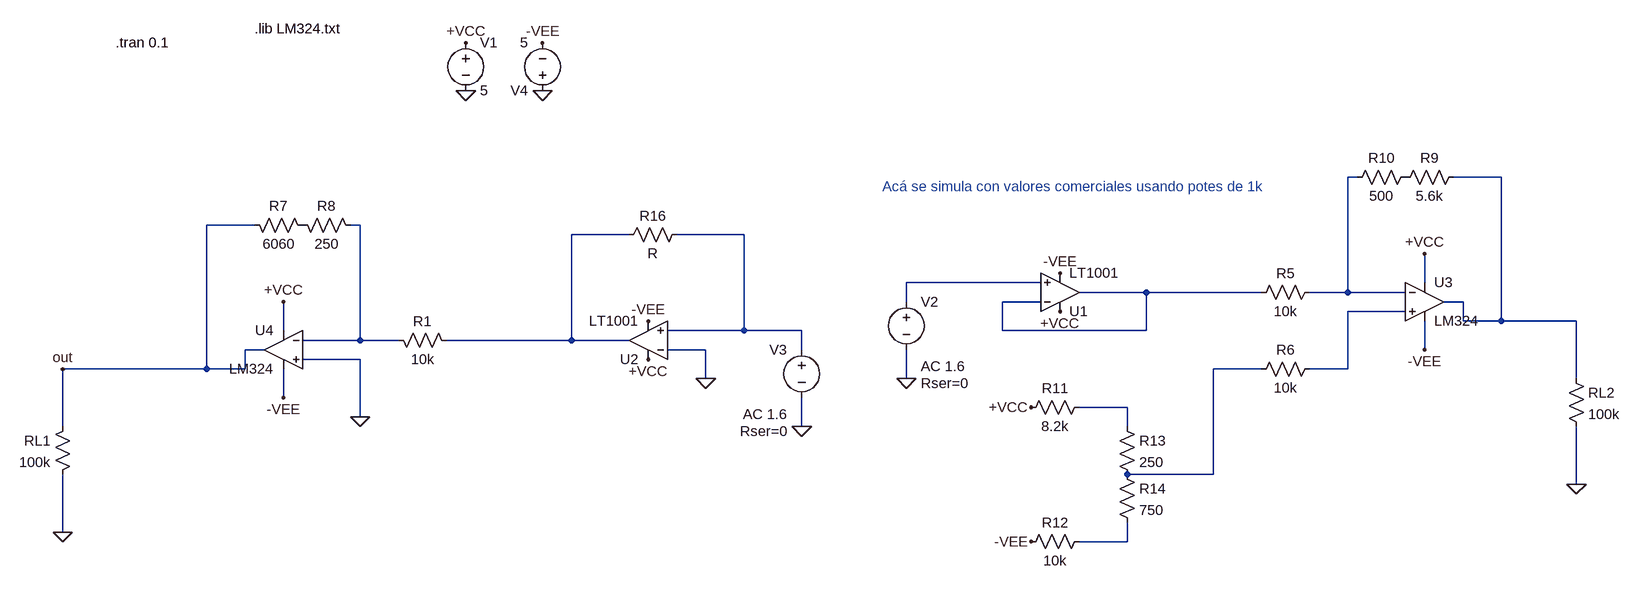
[diagram p0: schematic amplificador_adc_corriente.asc]
amplificador_adc_corriente.asc, the LTspice schematic file:
Version 4
SHEET 1 2452 980
WIRE 1888 -112 1872 -112
WIRE 2128 -112 2048 -112
WIRE -704 -32 -784 -32
WIRE -528 -32 -544 -32
WIRE -80 -16 -176 -16
WIRE 112 -16 0 -16
WIRE 1360 64 1136 64
WIRE 2000 64 2000 16
WIRE 1536 80 1424 80
WIRE 1728 80 1536 80
WIRE 1872 80 1872 -112
WIRE 1872 80 1808 80
WIRE 1968 80 1872 80
WIRE 1136 96 1136 64
WIRE 1360 96 1296 96
WIRE 2064 96 2032 96
WIRE 1968 112 1872 112
WIRE 2064 128 2064 96
WIRE 2128 128 2128 -112
WIRE 2128 128 2064 128
WIRE 2368 128 2128 128
WIRE -656 144 -656 96
WIRE 112 144 112 -16
WIRE 112 144 -16 144
WIRE 208 144 112 144
WIRE 1296 144 1296 96
WIRE 1536 144 1536 80
WIRE 1536 144 1296 144
WIRE -528 160 -528 -32
WIRE -528 160 -624 160
WIRE -464 160 -528 160
WIRE -176 160 -176 -16
WIRE -176 160 -384 160
WIRE -80 160 -176 160
WIRE -688 176 -720 176
WIRE 48 176 -16 176
WIRE 208 176 208 144
WIRE 2000 176 2000 128
WIRE -528 192 -624 192
WIRE -784 208 -784 -32
WIRE -784 208 -1024 208
WIRE -720 208 -720 176
WIRE -720 208 -784 208
WIRE 1728 208 1648 208
WIRE 1872 208 1872 112
WIRE 1872 208 1808 208
WIRE 48 224 48 176
WIRE 1136 224 1136 176
WIRE 2368 224 2368 128
WIRE -656 256 -656 208
WIRE 1504 272 1424 272
WIRE -528 288 -528 192
WIRE -1024 304 -1024 208
WIRE 208 304 208 256
WIRE 1504 304 1504 272
WIRE 1648 384 1648 208
WIRE 1648 384 1504 384
WIRE 2368 400 2368 304
WIRE -1024 480 -1024 384
WIRE 1504 496 1504 464
WIRE 1504 496 1424 496
FLAG -656 96 +VCC
FLAG -352 -256 0
FLAG -352 -336 +VCC
FLAG 208 304 0
FLAG -224 -256 0
FLAG -224 -336 -VEE
FLAG -656 256 -VEE
FLAG -48 192 +VCC
FLAG -48 128 -VEE
FLAG -1024 480 0
FLAG -1024 208 out
FLAG 2000 16 +VCC
FLAG 1136 224 0
FLAG 2000 176 -VEE
FLAG 1392 112 +VCC
FLAG 1392 48 -VEE
FLAG 2368 400 0
FLAG 1344 272 +VCC
FLAG 1344 496 -VEE
FLAG 48 224 0
FLAG -528 288 0
SYMBOL voltage -352 -352 R0
WINDOW 123 0 0 Left 2
WINDOW 39 0 0 Left 2
SYMATTR InstName V1
SYMATTR Value 5
SYMBOL voltage 208 160 M0
WINDOW 123 24 124 Left 2
WINDOW 39 24 152 Left 2
WINDOW 3 24 96 Invisible 2
SYMATTR Value2 AC 1.6
SYMATTR SpiceLine Rser=0
SYMATTR Value PWL TIME_SCALE_FACTOR=0.1 VALUE_SCALE_FACTOR=1 REPEAT FOREVER (file=triangularDAC_0a3.2V_256pts.txt) ENDREPEAT
SYMATTR InstName V3
SYMBOL res -480 144 M90
WINDOW 0 0 56 VBottom 2
WINDOW 3 32 56 VTop 2
SYMATTR InstName R1
SYMATTR Value 10k
SYMBOL voltage -224 -240 R180
WINDOW 123 0 0 Left 2
WINDOW 39 0 0 Left 2
SYMATTR InstName V4
SYMATTR Value 5
SYMBOL Opamps\\LT1001 -48 224 R180
SYMATTR InstName U2
SYMBOL Opamps\\opamp2 -656 112 M0
SYMATTR InstName U4
SYMATTR Value LM324
SYMBOL res -1008 288 M0
SYMATTR InstName RL1
SYMATTR Value 100k
SYMBOL res -720 -48 M90
WINDOW 0 0 56 VBottom 2
WINDOW 3 32 56 VTop 2
SYMATTR InstName R7
SYMATTR Value 6060
SYMBOL res -640 -48 M90
WINDOW 0 0 56 VBottom 2
WINDOW 3 32 56 VTop 2
SYMATTR InstName R8
SYMATTR Value 250
SYMBOL voltage 1136 80 R0
WINDOW 123 24 124 Left 2
WINDOW 39 24 152 Left 2
WINDOW 3 24 96 Invisible 2
SYMATTR Value2 AC 1.6
SYMATTR SpiceLine Rser=0
SYMATTR Value PWL TIME_SCALE_FACTOR=0.1 VALUE_SCALE_FACTOR=1 REPEAT FOREVER (file=triangularDAC_0a3.2V_256pts.txt) ENDREPEAT
SYMATTR InstName V2
SYMBOL res 1824 64 R90
WINDOW 0 0 56 VBottom 2
WINDOW 3 32 56 VTop 2
SYMATTR InstName R5
SYMATTR Value 10k
SYMBOL Opamps\\LT1001 1392 144 M180
SYMATTR InstName U1
SYMBOL Opamps\\opamp2 2000 32 R0
SYMATTR InstName U3
SYMATTR Value LM324
SYMBOL res 2352 208 R0
SYMATTR InstName RL2
SYMATTR Value 100k
SYMBOL res 1824 192 R90
WINDOW 0 0 56 VBottom 2
WINDOW 3 32 56 VTop 2
SYMATTR InstName R6
SYMATTR Value 10k
SYMBOL res 2064 -128 R90
WINDOW 0 0 56 VBottom 2
WINDOW 3 32 56 VTop 2
SYMATTR InstName R9
SYMATTR Value 5.6k
SYMBOL res 1984 -128 R90
WINDOW 0 0 56 VBottom 2
WINDOW 3 32 56 VTop 2
SYMATTR InstName R10
SYMATTR Value 500
SYMBOL res 1440 256 R90
WINDOW 0 0 56 VBottom 2
WINDOW 3 32 56 VTop 2
SYMATTR InstName R11
SYMATTR Value 8.2k
SYMBOL res 1440 480 R90
WINDOW 0 0 56 VBottom 2
WINDOW 3 32 56 VTop 2
SYMATTR InstName R12
SYMATTR Value 10k
SYMBOL res 1488 288 R0
SYMATTR InstName R13
SYMATTR Value 250
SYMBOL res 1488 368 R0
SYMATTR InstName R14
SYMATTR Value 750
SYMBOL res 16 -32 R90
WINDOW 0 0 56 VBottom 2
WINDOW 3 32 56 VTop 2
SYMATTR InstName R16
TEXT -936 -336 Left 2 !.tran 0.1
TEXT -704 -360 Left 2 !.lib LM324.txt
TEXT 1096 -96 Left 2 ;Acá se simula con valores comerciales usando potes de 1k

The netlist it stands for:
* amplificador_adc_corriente.asc
V1 +VCC 0 5
V3 N005 0 PWL TIME_SCALE_FACTOR=0.1 VALUE_SCALE_FACTOR=1 REPEAT FOREVER (file=triangularDAC_0a3.2V_256pts.txt) ENDREPEAT AC 1.6 Rser=0
R1 N003 N004 10k
V4 0 -VEE 5
XU2 N005 0 +VCC -VEE N004 LT1001  ; pins In+ In- V+ V- OUT
XU4 0 N003 +VCC -VEE out LM324  ; pins In+ In- V+ V- OUT
RL1 out 0 100k
R7 out P001 6060
R8 P001 N003 250
V2 N006 0 PWL TIME_SCALE_FACTOR=0.1 VALUE_SCALE_FACTOR=1 REPEAT FOREVER (file=triangularDAC_0a3.2V_256pts.txt) ENDREPEAT AC 1.6 Rser=0
R5 N001 N007 10k
XU1 N006 N007 +VCC -VEE N007 LT1001  ; pins In+ In- V+ V- OUT
XU3 N008 N001 +VCC -VEE N002 LM324  ; pins In+ In- V+ V- OUT
RL2 N002 0 100k
R6 N008 N009 10k
R9 N002 P002 5.6k
R10 P002 N001 500
R11 N010 +VCC 8.2k
R12 N011 -VEE 10k
R13 N010 N009 250
R14 N009 N011 750
R16 N005 N004 R
.tran 0.1
.lib LM324.txt
* Acá se simula con valores comerciales usando potes de 1k
.lib LTC.lib
.backanno
.end